# EasyEDA Pro project RAK3112 + RS485 P2P Node V1.1.epro

# Schematic Schematic1

## Sheets
1 P1: Board Name: Board1; Create Date: 2026-04-28; Page Name: P1; Project Name: RAK3312+ RS485; Schematic Name: Schematic1; Update Date: 2026-04-29; Company: EasyEDA.com; Page Size: A4; Version: V1.0
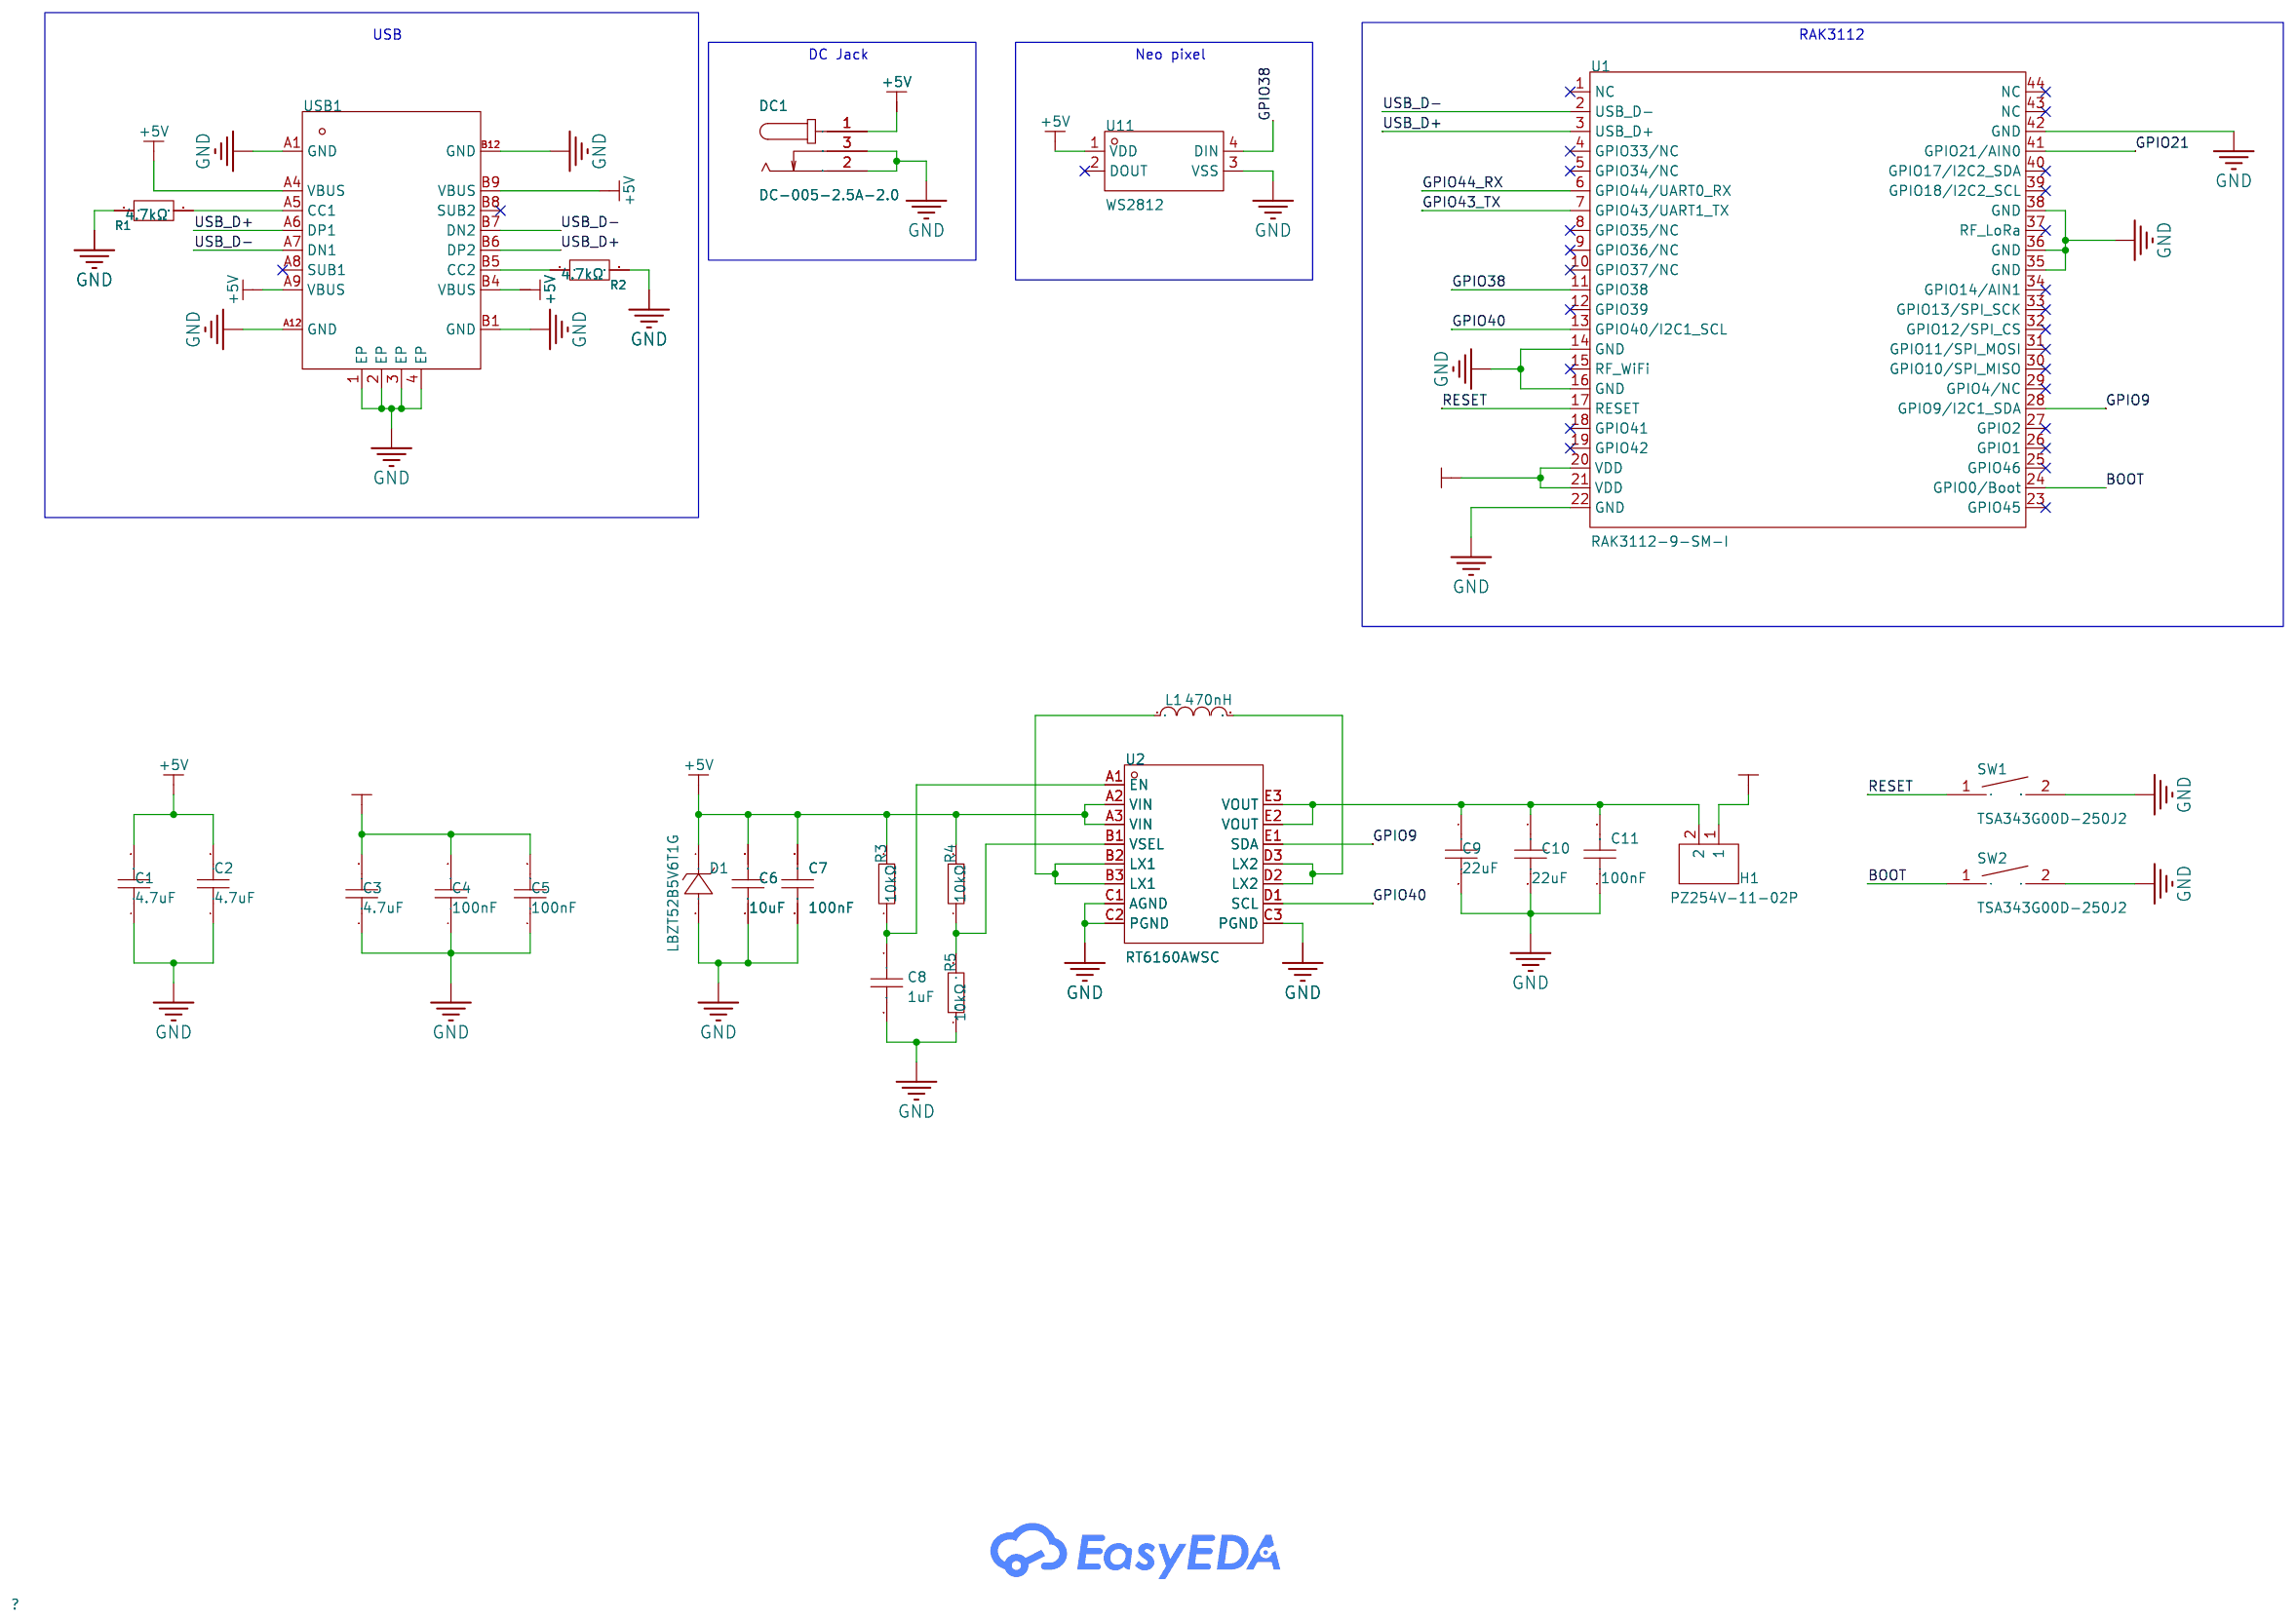
[diagram p0: P1]
2 RS484: Page Name: RS484
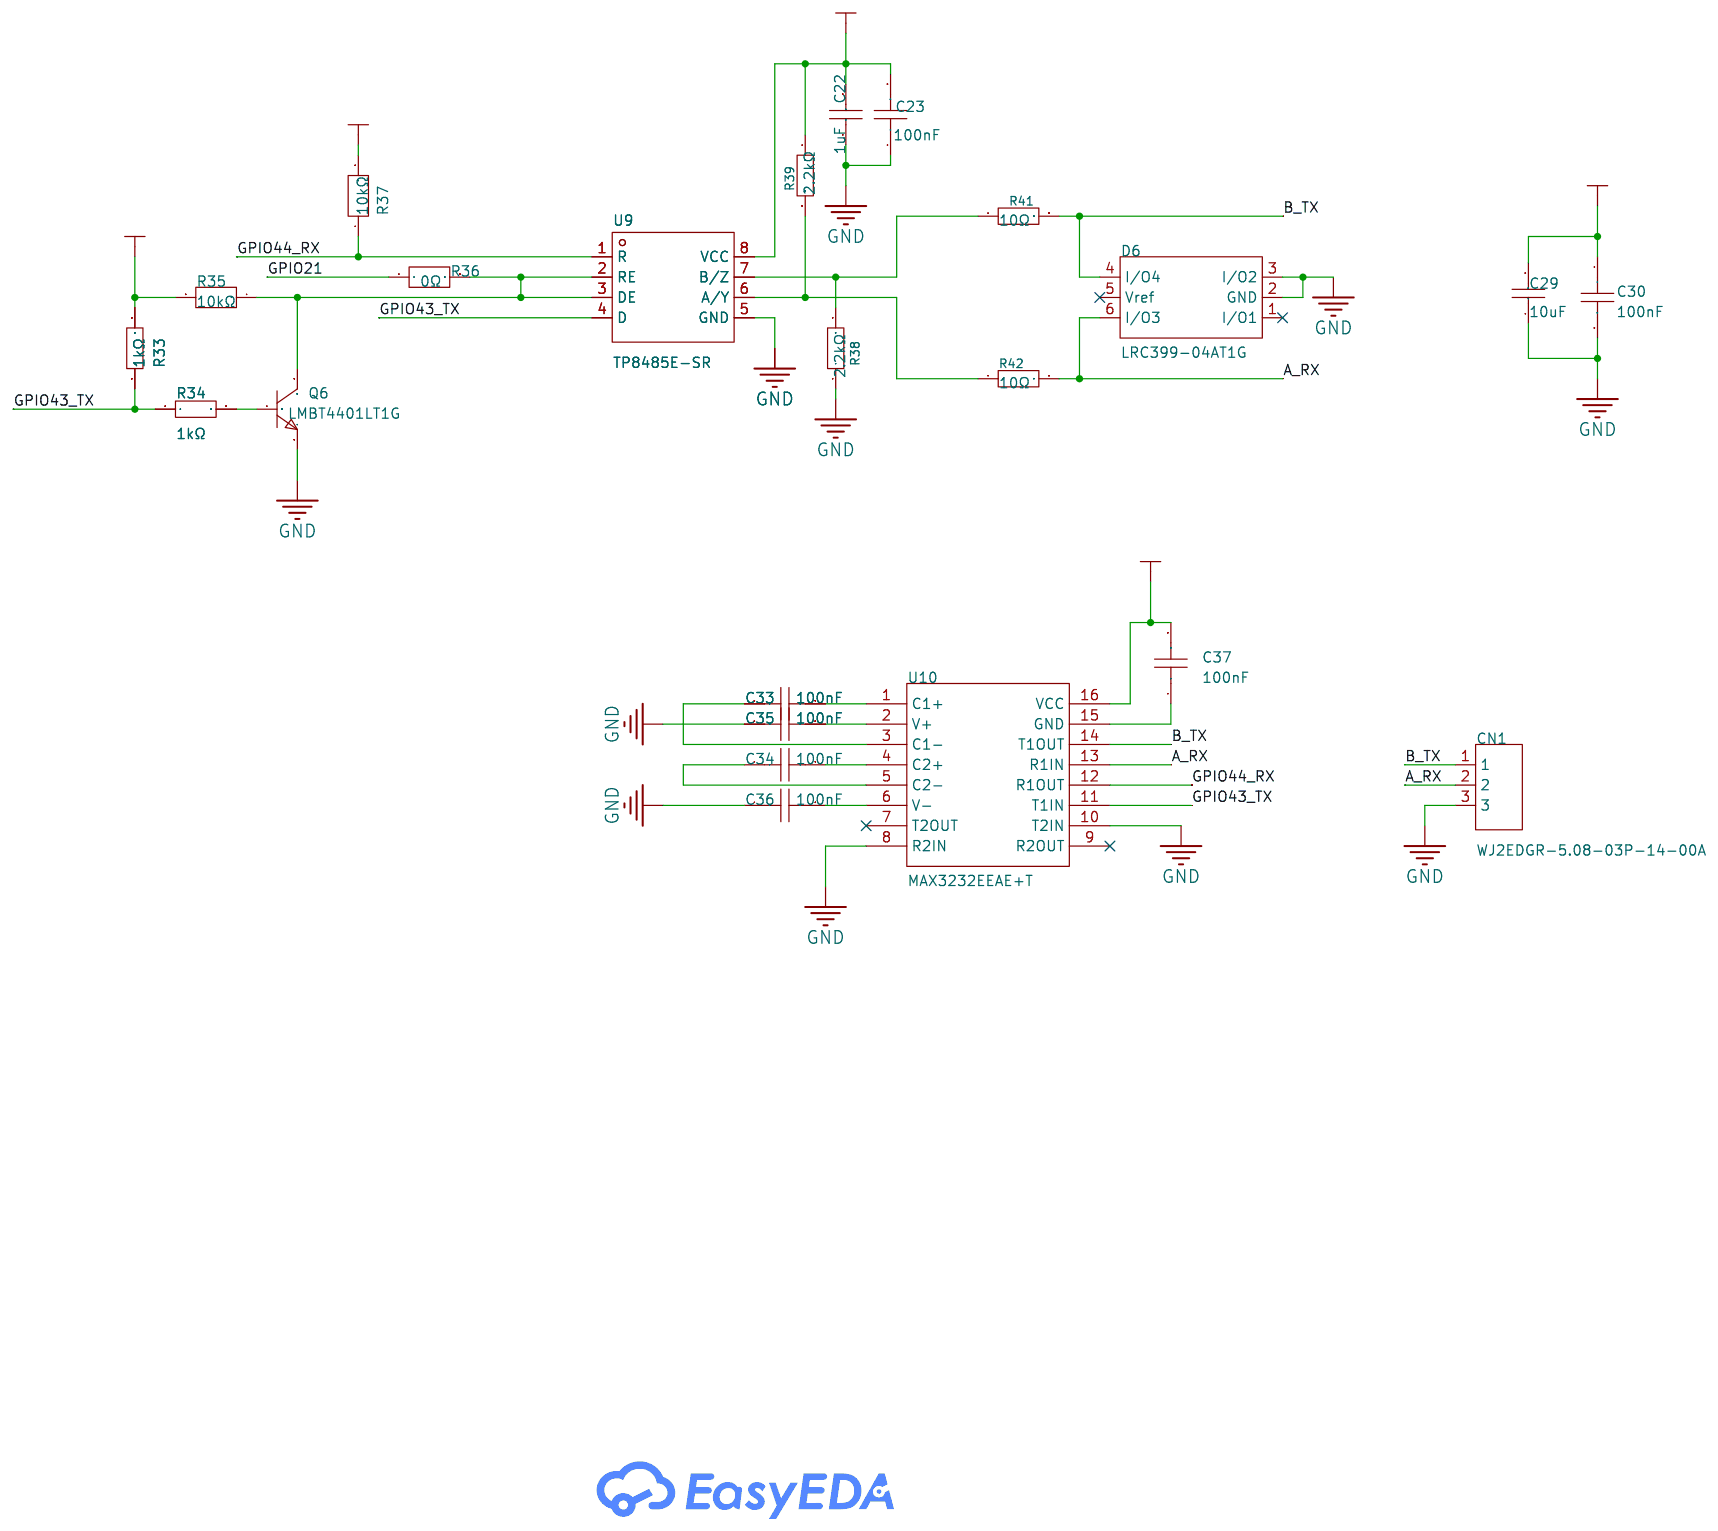
[diagram p1: RS484]

## Parts
sheet P1
C1  4.7uF  [C0603]
C2  4.7uF  [C0603]
C3  4.7uF  [C0603]
C4  100nF  [C0603]
C5  100nF  [C0603]
C6  10uF  [C0603]
C7  100nF  [C0603]
C8  1uF  [C0603]
C9  22uF  [C0603]
C10  22uF  [C0603]
C11  100nF  [C0603]
D1  LBZT52B5V6T1G  [SOD-123_L2.7-W1.6-LS3.7-RD-1]
DC1  DC-005-2.5A-2.0  [CONN-TH_DC-005-2.5A-2.0]
H1  PZ254V-11-02P  [HDR-TH_2P-P2.54-V-M]
L1  470nH  [IND-SMD_L4.4-W4.2]
R1  4.7kΩ  [R0603]
R2  4.7kΩ  [R0603]
R3  10kΩ  [R0603]
R4  10kΩ  [R0603]
R5  10kΩ  [R0603]
SW1  TSA343G00D-250J2  [SW-SMD_L4.0-W2.9-P4.15-EH]
SW2  TSA343G00D-250J2  [SW-SMD_L4.0-W2.9-P4.15-EH]
U1  RAK3112-9-SM-I  [COMM-SMD_44P-L23.0-W15.0-P1.20_RAK3112-9-SM-I]
U2  RT6160AWSC  [WLCSP-15_L2.3-W1.4-R3-C5-P0.40-BL]
U11  WS2812  [LED-SMD_4P-L5.0-W5.0-TL-A]
USB1  -  [USB-C-SMD_KH-TYPE-C-16P]
sheet RS484
C22  1uF  [C0402]
C23  100nF  [C0402]
C29  10uF  [C0402]
C30  100nF  [C0402]
C33  100nF  [C0603]
C34  100nF  [C0603]
C35  100nF  [C0603]
C36  100nF  [C0603]
C37  100nF  [C0603]
CN1  WJ2EDGR-5.08-03P-14-00A  [CONN-TH_3P-P5.08_WJ2EDGR-5.08-3P]
D6  LRC399-04AT1G  [TSOP-6_L3.0-W1.5-P0.95-BL]
Q6  LMBT4401LT1G  [SOT-23-3_L2.9-W1.3-P1.90-LS2.4-BR]
R33  1kΩ  [R0402]
R34  1kΩ  [R0402]
R35  10kΩ  [R0603]
R36  0Ω  [R0805]
R37  10kΩ  [R0603]
R38  2.2kΩ  [R0402]
R39  2.2kΩ  [R0402]
R41  10Ω  [R0402]
R42  10Ω  [R0402]
U9  TP8485E-SR  [SOIC-8_L5.0-W4.0-P1.27-LS6.0-BL]
U10  MAX3232EEAE+T  [SSOP-16_L6.2-W5.3-P0.65-LS7.8-BL]

## Library data of the parts
C1-C3 = CL10A475KO8NNNC: Capacitance:4.7uF Tolerance:±10% Tolerance:±10% Voltage Rating:16V Temperature Coefficient:X5R; LCSC Part Name: 4.7uF ±10% 16V; Supplier Part: C19666; Manufacturer: SAMSUNG(三星); Supplier Footprint: 0603; JLCPCB Part Class: Basic Part; Datasheet: https://item.szlcsc.com/datasheet/CL10A475KO8NNNC/20375.html; Supplier: LCSC; Tolerance: ±10%; Voltage Rating: 16V; Temperature Coefficient: X5R
C4 C5 C7 C11 = TCC0603X7R104K500CT: Capacitance:100nF Tolerance:±10% Tolerance:±10% Voltage Rating:50V Temperature Coefficient:X7R; LCSC Part Name: 100nF ±10% 50V; Supplier Part: C282519; Manufacturer: CCTC(三环); Supplier Footprint: 0603; JLCPCB Part Class: Extended Part; Datasheet: https://item.szlcsc.com/datasheet/TCC0603X7R104K500CT/268639.html; Supplier: LCSC; Tolerance: ±10%; Voltage Rating: 50V; Temperature Coefficient: X7R
C6 = CGA0603X5R106K100JT: Capacitance:10uF Tolerance:±10% Tolerance:±10% Voltage Rating:10V Temperature Coefficient:X5R; LCSC Part Name: 10uF ±10% 10V; Supplier Part: C6119842; Manufacturer: HRE(芯声); Supplier Footprint: 0603; JLCPCB Part Class: Extended Part; Datasheet: https://item.szlcsc.com/datasheet/CGA0603X5R106K100JT/7062548.html; Supplier: LCSC; Tolerance: ±10%; Voltage Rating: 10V; Temperature Coefficient: X5R
C8 = CL10B105KB8NQNC: Capacitance:1uF Tolerance:±10% Tolerance:±10% Voltage Rating:50V Temperature Coefficient:X7R; LCSC Part Name: 1uF ±10% 50V; Supplier Part: C5199872; Manufacturer: SAMSUNG(三星); Supplier Footprint: 0603; JLCPCB Part Class: Extended Part; Datasheet: https://item.szlcsc.com/datasheet/CL10B105KB8NQNC/5885909.html; Supplier: LCSC; Tolerance: ±10%; Voltage Rating: 50V; Temperature Coefficient: X7R
C9 C10 = CL10A226MQ8NRNC: Capacitance:22uF Tolerance:±20% Tolerance:±20% Voltage Rating:6.3V Temperature Coefficient:X5R; LCSC Part Name: 22uF ±20% 6.3V; Supplier Part: C59461; Manufacturer: SAMSUNG(三星); Supplier Footprint: 0603; JLCPCB Part Class: Basic Part; Datasheet: https://item.szlcsc.com/datasheet/CL10A226MQ8NRNC/60514.html; Supplier: LCSC; Tolerance: ±20%; Voltage Rating: 6.3V; Temperature Coefficient: X5R
D1 = LBZT52B5V6T1G: Diode Configuration:Independent Zener Voltage(Nom):5.6V Reverse Leakage Current (Ir):1uA Zener Voltage(Range):5.49V~5.73V Zener Voltage(Range):5.49V~5.73V Pd - Power Dissipation:500mW Impedance(Zzt):60Ω Impedance(Zzk):200Ω Operating Junction Temperature R; LCSC Part Name: 独立式 耐压:5.6V 电流:1uA; Supplier Part: C2912016; Manufacturer: LRC(乐山无线电); Supplier Footprint: SOD-123; JLCPCB Part Class: Extended Part; Datasheet: https://item.szlcsc.com/datasheet/LBZT52B5V6T1G/3194274.html; Supplier: LCSC; Diode Configuration: Independent; Zener Voltage(Nom): 5.6V; Reverse Leakage Current (Ir): 1uA; Zener Voltage(Range): 5.49V~5.73V; Pd - Power Dissipation: 500mW; Impedance(Zzt): 60Ω; Impedance(Zzk): 200Ω; Operating Junction Temperature Range: -55℃~+150℃
DC1 = DC-005-2.5A-2.0: Connector Type:DC Power Jack Mounting Type:Panel Mount Inside Contact Diameter:2mm Outside Contact Diameter:6.2mm Current Rating:- Voltage Rating (Max):- Operating Temperature:-20℃~+70℃ Operating Temperature:-20℃~+70℃; LCSC Part Name: DC电源插座 内径:2mm 外径:6.2mm; Supplier Part: C319099; Manufacturer: XKB Connection(中国星坤); Supplier Footprint: 插件; JLCPCB Part Class: Extended Part; Datasheet: https://item.szlcsc.com/datasheet/DC-005-2.5A-2.0/300191.html; Supplier: LCSC; Connector Type: DC Power Jack; Mounting Type: Panel Mount; Inside Contact Diameter: 2mm; Outside Contact Diameter: 6.2mm; Operating Temperature: -20℃~+70℃
H1 = PZ254V-11-02P: Pin Structure:1x2P Pitch:2.54mm Row Spacing:- Circluar Pins/Square Pins:Pin Header Mounting Type:Through Hole Number of Rows:1 Number of Pins:2P Current Rating:3A Voltage Rating (Max):250V Length of Mating Pin:6mm Insulation Height:2.5mm Length of End Con; LCSC Part Name: 1x2P 间距:2.54mm 方针 直插; Supplier Part: C492401; Manufacturer: XFCN(兴飞); Supplier Footprint: 插件,P=2.54mm; JLCPCB Part Class: Extended Part; Datasheet: https://item.szlcsc.com/datasheet/PZ254V-11-02P/502957.html; Supplier: LCSC; Pin Structure: 1x2P; Pitch: 2.54mm; Circluar Pins/Square Pins: Pin Header; Mounting Type: Through Hole; Number of Rows: 1; Number of Pins: 2P; Current Rating: 3A; Voltage Rating (Max): 250V; Length of Mating Pin: 6mm; Insulation Height: 2.5mm; Length of End Connection Pin: 3mm; Contact Material: Brass; Operating Temperature: -40℃~+105℃; Color: Black
L1 = FXL0420-R47-M: Inductance:470nH Tolerance:±20% Tolerance:±20% Current Rating:7.5A Current - Saturation(Isat):9.5A DC Resistance(DCR):14mΩ Type:Molded Inductor; LCSC Part Name: 470nH ±20% 9.5A; Supplier Part: C167200; Manufacturer: cjiang(长江微电); Supplier Footprint: SMD,4.4x4.2mm; JLCPCB Part Class: Extended Part; Datasheet: https://item.szlcsc.com/datasheet/FXL0420-R47-M/178583.html; Supplier: LCSC; Tolerance: ±20%; Current Rating: 7.5A; Current - Saturation(Isat): 9.5A; DC Resistance(DCR): 14mΩ; Type: Molded Inductor
R1 R2 = FRC0603J472 TS: Type:Thick Film Resistor Resistance:4.7kΩ Tolerance:±5% Tolerance:±5% Power(Watts):100mW Voltage-Supply(Max):75V Temperature Coefficient:±100ppm/℃ Temperature Coefficient:±100ppm/℃ Operating Temperature:-55℃~+155℃ Operating Temperature:-55℃~+155℃; LCSC Part Name: 4.7kΩ ±5% 100mW 厚膜电阻; Supplier Part: C2907166; Manufacturer: FOJAN(富捷); Supplier Footprint: 0603; JLCPCB Part Class: Extended Part; Supplier: LCSC; Type: Thick Film Resistor; Tolerance: ±5%; Power(Watts): 100mW; Voltage-Supply(Max): 75V; Temperature Coefficient: ±100ppm/℃; Operating Temperature: -55℃~+155℃
R3-R5 = RC0603FR-0710KL: Type:Thick Film Resistors Resistance: Tolerance:±1% Tolerance:±1% Power(Watts): Overload Voltage (Max): Temperature Coefficient:±100ppm/℃ Temperature Coefficient:±100ppm/℃ Operating Temperature Range:-55℃~+155℃ Operating Temperature Range:-55℃~+155℃; LCSC Part Name: 厚膜电阻 10kΩ ±1% 100mW; Supplier Part: C98220; Manufacturer: YAGEO(国巨); Supplier Footprint: 0603; JLCPCB Part Class: Extended Part; Datasheet: https://atta.szlcsc.com/upload/public/pdf/source/20180927/C295883_E8D83085EA81BD7DE0B2B681138C15EE.pdf; Supplier: LCSC; Type: Thick Film Resistors; Tolerance: ±1%; Temperature Coefficient: ±100ppm/℃; Operating Temperature Range: -55℃~+155℃
SW1 SW2 = TSA343G00D-250J2: Circuit:SPST Actuator Style:Round Button Operating Force:2.5N Mounting Type:Surface Mount,Vertical Length:4mm Width:3mm Switch Height:2mm with Bracket:Without Bracket Contact Current:50mA Voltage Rating:12V Actuator/Cap Color:Black With Lamp:No Terminatio; LCSC Part Name: 4x3x2mm两脚小龟 带柱 立贴 轻触开关; Supplier Part: C354947; Manufacturer: BRIGHT(博瑞泰); Supplier Footprint: SMD; JLCPCB Part Class: Extended Part; Datasheet: https://item.szlcsc.com/datasheet/TSA343G00D-250J2/330472.html; Supplier: LCSC; Circuit: SPST; Actuator Style: Round Button; Operating Force: 2.5N; Mounting Type: Surface Mount,Vertical; Length: 4mm; Width: 3mm; Switch Height: 2mm; with Bracket: Without Bracket; Contact Current: 50mA; Voltage Rating: 12V; Actuator/Cap Color: Black; With Lamp: No; Termination Style: SMD(SMT) Tab; Life: 50,000 Cycles; Operating Temperature: -25℃~+70℃
U1 = RAK3112-9-SM-I: LCSC Part Name: WisDuo Module for LoRaWAN RAK3112(H) /With IPEX/900MHz for US915/AU915/KR920/AS923; Supplier Part: C51883856; Manufacturer: RAK(瑞科慧联); JLCPCB Part Class: Extended Part; Datasheet: https://item.szlcsc.com/datasheet/RAK3112-9-SM-I/54552325.html; Supplier: LCSC
U2 = RT6160AWSC: Function:Boost type Output Type:Adjustable Input Voltage:2.2V~5.5V Input Voltage:2.2V~5.5V Output Current:3A Switching Frequency:2.2MHz Switching Frequency:2.2MHz Operating Temperature:-40℃~+125℃ Operating Temperature:-40℃~+125℃ Synchronous Rectification:; LCSC Part Name: 高效能3A升降压转换器; Supplier Part: C7065276; Manufacturer: RICHTEK(立锜); Supplier Footprint: WLCSP-15B(2.3x1.4); JLCPCB Part Class: Extended Part; Datasheet: https://atta.szlcsc.com/upload/public/pdf/source/231023/DS6160A-02-00831268e7d061f0dfa5290b00560405.pdf; Supplier: LCSC; Function: Boost type; Output Type: Adjustable; Input Voltage: 2.2V~5.5V; Output Current: 3A; Switching Frequency: 2.2MHz; Operating Temperature: -40℃~+125℃; Synchronous Rectification: Yes; Number of Outputs: 1; Topology: Step-down-Boost; Quiescent Current (Iq): 1uA; Switch tube (built-in/external): Built-in
U11 = WS2812: Supplier Part: C42417498; Manufacturer: worldsemi; Supplier Footprint: SMD5050-4P; JLCPCB Part Class: Extended Part; Datasheet: https://item.szlcsc.com/datasheet/WS2812/44423158.html; Supplier: LCSC
USB1 = USB_TYPE-C-16P: Supplier Footprint: Through
C22 = CL05A105KP5NNNC: Capacitance:1uF Tolerance:±10% Tolerance:±10% Voltage Rating:10V Temperature Coefficient:X5R; LCSC Part Name: 1uF ±10% 10V; Supplier Part: C14445; Manufacturer: SAMSUNG(三星); Supplier Footprint: 0402; JLCPCB Part Class: Extended Part; Datasheet: https://item.szlcsc.com/datasheet/CL05A105KP5NNNC/15107.html; Supplier: LCSC; Tolerance: ±10%; Voltage Rating: 10V; Temperature Coefficient: X5R
C23 C30 = FCC0402B104K160AT: Capacitance:100nF Tolerance:±10% Tolerance:±10% Voltage Rating:16V Temperature Coefficient:X7R; LCSC Part Name: 100nF ±10% 16V; Supplier Part: C5137468; Manufacturer: FOJAN(富捷); Supplier Footprint: 0402; JLCPCB Part Class: Extended Part; Datasheet: https://item.szlcsc.com/datasheet/FCC0402B104K160AT/5746970.html; Supplier: LCSC; Tolerance: ±10%; Voltage Rating: 16V; Temperature Coefficient: X7R
C29 = GRM155R60J106ME44D: Capacitance:10uF Tolerance:±20% Tolerance:±20% Voltage Rating:6.3V Temperature Coefficient:X5R; LCSC Part Name: 10uF ±20% 6.3V; Supplier Part: C76991; Manufacturer: muRata(村田); Supplier Footprint: 0402; JLCPCB Part Class: Extended Part; Datasheet: https://item.szlcsc.com/datasheet/GRM155R60J106ME44D/78118.html; Supplier: LCSC; Tolerance: ±20%; Voltage Rating: 6.3V; Temperature Coefficient: X5R
C33-C37 = CGA0603X7R104K100JT: Capacitance: Tolerance:±10% Tolerance:±10% Voltage Rating: Temperature Coefficient:; LCSC Part Name: 100nF ±10% 10V; Supplier Part: C36911391; Manufacturer: HRE(芯声); Supplier Footprint: 0603; JLCPCB Part Class: Extended Part; Datasheet: https://atta.szlcsc.com/upload/public/pdf/source/20240730/89545F503D4A4D0BCBA4819B495739F3.pdf; Supplier: LCSC; Tolerance: ±10%
CN1 = WJ2EDGR-5.08-03P-14-00A: Connector Type:Board Side/Socket - Open Termination Style:Hinged (Snap On) Number of Positions or Pins:1x3P Pitch:5.08mm Color:Green Mounting Type:Right-Angle Number of Pins:3P Number of Rows:1 Number of PINs Per Row:3 Current Rating:10A Voltage Rating (M; LCSC Part Name: 卡扣固定 1x3P 5.08mm 排数:1 每排P数:3; Supplier Part: C70914; Manufacturer: KANGNEX(康奈克斯电气); Supplier Footprint: 弯插,P=5.08mm; JLCPCB Part Class: Extended Part; Datasheet: https://item.szlcsc.com/datasheet/WJ2EDGR-5.08-03P-14-00A/72013.html; Supplier: LCSC; Connector Type: Board Side/Socket - Open; Termination Style: Hinged (Snap On); Number of Positions or Pins: 1x3P; Pitch: 5.08mm; Color: Green; Mounting Type: Right-Angle; Number of Pins: 3P; Number of Rows: 1; Number of PINs Per Row: 3; Current Rating: 10A; Voltage Rating (Max): 300V; Operating Temperature: -40℃~+105℃
D6 = LRC399-04AT1G: Reverse Stand-Off Voltage (Vrwm):5V Clamping Voltage:8.5V Voltage - Breakdown:6V Reverse Leakage Current (Ir):1uA Type:ESD; Supplier Part: C5274371; Manufacturer: LRC(乐山无线电); Supplier Footprint: TSOP-6; JLCPCB Part Class: Extended Part; Datasheet: https://atta.szlcsc.com/upload/public/pdf/source/20221213/22056EDC41646EC6D8A74880FBA83D1E.pdf; Supplier: LCSC; Reverse Stand-Off Voltage (Vrwm): 5V; Clamping Voltage: 8.5V; Voltage - Breakdown: 6V; Reverse Leakage Current (Ir): 1uA; Type: ESD
Q6 = LMBT4401LT1G: type:NPN Current - Collector(Ic):600mA Collector - Emitter Voltage VCEO:40V Pd - Power Dissipation:225mW DC Current Gain:20@0.1mA,1V DC Current Gain:20@0.1mA,1V Transition frequency(fT):250MHz Current - Collector Cutoff:100nA Vce Saturation(VCE(sat)):400m; LCSC Part Name: 丝印2X NPN 电流:600mA 电压:40V; Supplier Part: C78591; Manufacturer: LRC(乐山无线电); Supplier Footprint: SOT-23; JLCPCB Part Class: Extended Part; Datasheet: https://item.szlcsc.com/datasheet/LMBT4401LT1G/79727.html; Supplier: LCSC; type: NPN; Current - Collector(Ic): 600mA; Collector - Emitter Voltage VCEO: 40V; Pd - Power Dissipation: 225mW; DC Current Gain: 20@0.1mA,1V; Transition frequency(fT): 250MHz; Current - Collector Cutoff: 100nA; Vce Saturation(VCE(sat)): 400mV; Operating Temperature: -55℃~+150℃
R33 R34 = 0402WGF1001TCE: Type:Thick Film Resistor Resistance:1kΩ Tolerance:±1% Tolerance:±1% Power(Watts):62.5mW Voltage-Supply(Max):50V Temperature Coefficient:±100ppm/℃ Temperature Coefficient:±100ppm/℃ Operating Temperature:-55℃~+155℃ Operating Temperature:-55℃~+155℃; LCSC Part Name: 1kΩ ±1% 62.5mW 厚膜电阻; Supplier Part: C11702; Manufacturer: UNI-ROYAL(厚声); Supplier Footprint: 0402; JLCPCB Part Class: Basic Part; Datasheet: https://item.szlcsc.com/datasheet/0402WGF1001TCE/12256.html; Supplier: LCSC; Type: Thick Film Resistor; Tolerance: ±1%; Power(Watts): 62.5mW; Voltage-Supply(Max): 50V; Temperature Coefficient: ±100ppm/℃; Operating Temperature: -55℃~+155℃
R35 R37 = FRC0603J103 TS: Type:Thick Film Resistor Resistance:10kΩ Tolerance:±5% Tolerance:±5% Power(Watts):100mW Voltage-Supply(Max):75V Temperature Coefficient:±100ppm/℃ Temperature Coefficient:±100ppm/℃ Operating Temperature:-55℃~+155℃ Operating Temperature:-55℃~+155℃; LCSC Part Name: 10kΩ ±5% 100mW 厚膜电阻; Supplier Part: C2930027; Manufacturer: FOJAN(富捷); Supplier Footprint: 0603; JLCPCB Part Class: Extended Part; Datasheet: https://item.szlcsc.com/datasheet/FRC0603J103%2520TS/3266960.html; Supplier: LCSC; Type: Thick Film Resistor; Tolerance: ±5%; Power(Watts): 100mW; Voltage-Supply(Max): 75V; Temperature Coefficient: ±100ppm/℃; Operating Temperature: -55℃~+155℃
R36 = YLRY05-W2-0Z: Resistance:0Ω Power(Watts):500mW; LCSC Part Name: YLRY系列 0.5W 0mΩ; Supplier Part: C22468035; Manufacturer: yezhan(业展); Supplier Footprint: 0805; JLCPCB Part Class: Extended Part; Datasheet: https://item.szlcsc.com/datasheet/YLRY05-W2-0Z/24173369.html; Supplier: LCSC; Power(Watts): 500mW
R38 R39 = 0402WGF2201TCE: Type:Thick Film Resistor Resistance:2.2kΩ Tolerance:±1% Tolerance:±1% Power(Watts):62.5mW Voltage-Supply(Max):50V Temperature Coefficient:±100ppm/℃ Temperature Coefficient:±100ppm/℃ Operating Temperature:-55℃~+155℃ Operating Temperature:-55℃~+155℃; LCSC Part Name: 2.2kΩ ±1% 62.5mW 厚膜电阻; Supplier Part: C25879; Manufacturer: UNI-ROYAL(厚声); Supplier Footprint: 0402; JLCPCB Part Class: Basic Part; Datasheet: https://item.szlcsc.com/datasheet/0402WGF2201TCE/26622.html; Supplier: LCSC; Type: Thick Film Resistor; Tolerance: ±1%; Power(Watts): 62.5mW; Voltage-Supply(Max): 50V; Temperature Coefficient: ±100ppm/℃; Operating Temperature: -55℃~+155℃
R41 R42 = 0402WGF100JTCE: Type:Thick Film Resistor Resistance:10Ω Tolerance:±1% Tolerance:±1% Power(Watts):62.5mW Voltage-Supply(Max):50V Temperature Coefficient:±200ppm/℃ Temperature Coefficient:±200ppm/℃ Operating Temperature:-55℃~+155℃ Operating Temperature:-55℃~+155℃; LCSC Part Name: 10Ω ±1% 62.5mW 厚膜电阻; Supplier Part: C25077; Manufacturer: UNI-ROYAL(厚声); Supplier Footprint: 0402; JLCPCB Part Class: Basic Part; Datasheet: https://item.szlcsc.com/datasheet/0402WGF100JTCE/25820.html; Supplier: LCSC; Type: Thick Film Resistor; Tolerance: ±1%; Power(Watts): 62.5mW; Voltage-Supply(Max): 50V; Temperature Coefficient: ±200ppm/℃; Operating Temperature: -55℃~+155℃
U9 = TP8485E-SR: Types:Transceiver Number of Driver:1 Number of receiver:1 Supply Voltage:3V~5.5V Supply Voltage:3V~5.5V Data Rate:250Kbps Data Rate:250Kbps Node Number:256 ESD Protect:±18kV ESD Protect:±18kV Operating Temperature:-40℃~+125℃ Operating Temperature:-40℃~+12; LCSC Part Name: ±18K ESD保护，全故障安全RS-485收发器; Supplier Part: C94206; Manufacturer: 3PEAK(思瑞浦); Supplier Footprint: SOIC-8; JLCPCB Part Class: Extended Part; Datasheet: https://atta.szlcsc.com/upload/public/pdf/source/20170120/1484891310884.pdf; Supplier: LCSC; Types: Transceiver; Number of Driver: 1; Number of receiver: 1; Supply Voltage: 3V~5.5V; Data Rate: 250Kbps; Node Number: 256; ESD Protect: ±18kV; Operating Temperature: -40℃~+125℃
U10 = MAX3232EEAE+T: Type:transceiver Number of Drivers:- Number of Receivers:- Data Rate:1Mbps Data Rate:1Mbps Voltage - Supply:3V~5.5V Voltage - Supply:3V~5.5V ESD Protect:±15kV ESD Protect:±15kV charge pump:Yes Operating Temperature:-40℃~+85℃ Operating Temperature:-40℃~+85; LCSC Part Name: ±15kV ESD 保护，低至 10nA，3.0V 至 5.5V，高达 1Mbps，真正的 RS-232 收发器; Supplier Part: C33379; Manufacturer: ADI(亚德诺)/MAXIM(美信); Supplier Footprint: SSOP-16-208mil; JLCPCB Part Class: Extended Part; Datasheet: https://item.szlcsc.com/datasheet/MAX3232EEAE%252BT/34344.html; Supplier: LCSC; Type: transceiver; Data Rate: 1Mbps; Voltage - Supply: 3V~5.5V; ESD Protect: ±15kV; charge pump: Yes; Operating Temperature: -40℃~+85℃

## Nets
3V3: C3.2 C4.2 C5.2 C22.2 C23.2 C29.2 C30.1 C37.2 H1.1 R33.2 R35.2 R37.2 R39.1 U1.20(VDD) U1.21(VDD) U9.8(VCC) U10.16(VCC)
+5V: C1.2 C2.2 C6.2 C7.2 D1.1(K) DC1.1 R3.2 R4.2 U2.A2(VIN) U2.A3(VIN) U11.1(VDD) USB1.A4(VBUS) USB1.A9(VBUS) USB1.B4(VBUS) USB1.B9(VBUS)
GND: C1.1 C2.1 C3.1 C4.1 C5.1 C6.1 C7.1 C8.2 C9.2 C10.2 C11.1 C22.1 C23.1 C29.1 C30.2 C35.1 C36.1 CN1.3 D1.2(A) D6.2(GND) D6.3(I/O2) DC1.2 DC1.3 Q6.2(E) R1.1 R2.2 R5.1 R38.1 SW1.2 SW2.2 U1.14(GND) U1.16(GND) U1.22(GND) U1.35(GND) U1.36(GND) U1.38(GND) U1.42(GND) U2.C1(AGND) U2.C2(PGND) U2.C3(PGND) U9.5(GND) U10.8(R2IN) U10.10(T2IN) U11.3(VSS) USB1.1(EP) USB1.2(EP) USB1.3(EP) USB1.4(EP) USB1.A1(GND) USB1.A12(GND) USB1.B1(GND) USB1.B12(GND)
A_RX: CN1.2 D6.6(I/O3) R42.2 U10.13(R1IN)
B_TX: CN1.1 D6.4(I/O4) R41.2 U10.14(T1OUT)
BOOT: SW2.1 U1.24(GPIO0/Boot)
GPIO9: U1.28(GPIO9/I2C1_SDA) U2.E1(SDA)
GPIO21: R36.1 U1.41(GPIO21/AIN0)
GPIO38: U1.11(GPIO38) U11.4(DIN)
GPIO40: U1.13(GPIO40/I2C1_SCL) U2.D1(SCL)
GPIO43_TX: R33.1 R34.1 U1.7(GPIO43/UART1_TX) U9.4(D) U10.11(T1IN)
GPIO44_RX: R37.1 U1.6(GPIO44/UART0_RX) U9.1(R) U10.12(R1OUT)
RESET: SW1.1 U1.17(RESET)
USB_D+: U1.3(USB_D+) USB1.A6(DP1) USB1.B6(DP2)
USB_D-: U1.2(USB_D-) USB1.A7(DN1) USB1.B7(DN2)
$1N1486: R2.1 USB1.B5(CC2)
$1N1504: L1.1 U2.B2(LX1) U2.B3(LX1)
$1N1505: L1.2 U2.D2(LX2) U2.D3(LX2)
$1N1525: R1.2 USB1.A5(CC1)
$1N1571: C9.1 C10.1 C11.2 H1.2 U2.E2(VOUT) U2.E3(VOUT)
$1N1577: C8.1 R3.1 U2.A1(EN)
$1N1589: R4.1 R5.2 U2.B1(VSEL)
$2N1090: Q6.1(B) R34.2
$2N1107: R39.2 R42.1 U9.6(A/Y)
$2N1108: R38.2 R41.1 U9.7(B/Z)
$2N1109: Q6.3(C) R35.1 R36.2 U9.2(RE) U9.3(DE)
$2N1110: C33.1 U10.3(C1-)
$2N1111: C34.1 U10.5(C2-)
$2N1112: C33.2 U10.1(C1+)
$2N1113: C34.2 U10.4(C2+)
$2N1124: C35.2 U10.2(V+)
$2N1126: C36.2 U10.6(V-)
$2N1128: C37.1 U10.15(GND)

Not connected (* = marked no-connect by the designer): D6 1(I/O1)* 5(Vref)*; U1 1(NC)* 4(GPIO33/NC)* 5(GPIO34/NC)* 8(GPIO35/NC)* 9(GPIO36/NC)* 10(GPIO37/NC)* 12(GPIO39)* 15(RF_WiFi)* 18(GPIO41)* 19(GPIO42)* 23(GPIO45)* 25(GPIO46)* 26(GPIO1)* 27(GPIO2)* 29(GPIO4/NC)* 30(GPIO10/SPI_MISO)* 31(GPIO11/SPI_MOSI)* 32(GPIO12/SPI_CS)* 33(GPIO13/SPI_SCK)* 34(GPIO14/AIN1)* 37(RF_LoRa)* 39(GPIO18/I2C2_SCL)* 40(GPIO17/I2C2_SDA)* 43(NC)* 44(NC)*; U10 7(T2OUT)* 9(R2OUT)*; U11 2(DOUT)*; USB1 A8(SUB1)* B8(SUB2)*

## Notes on the sheets
sheet 1
- USB
- RAK3112
- DC Jack
- Neo pixel

# Board PCB1
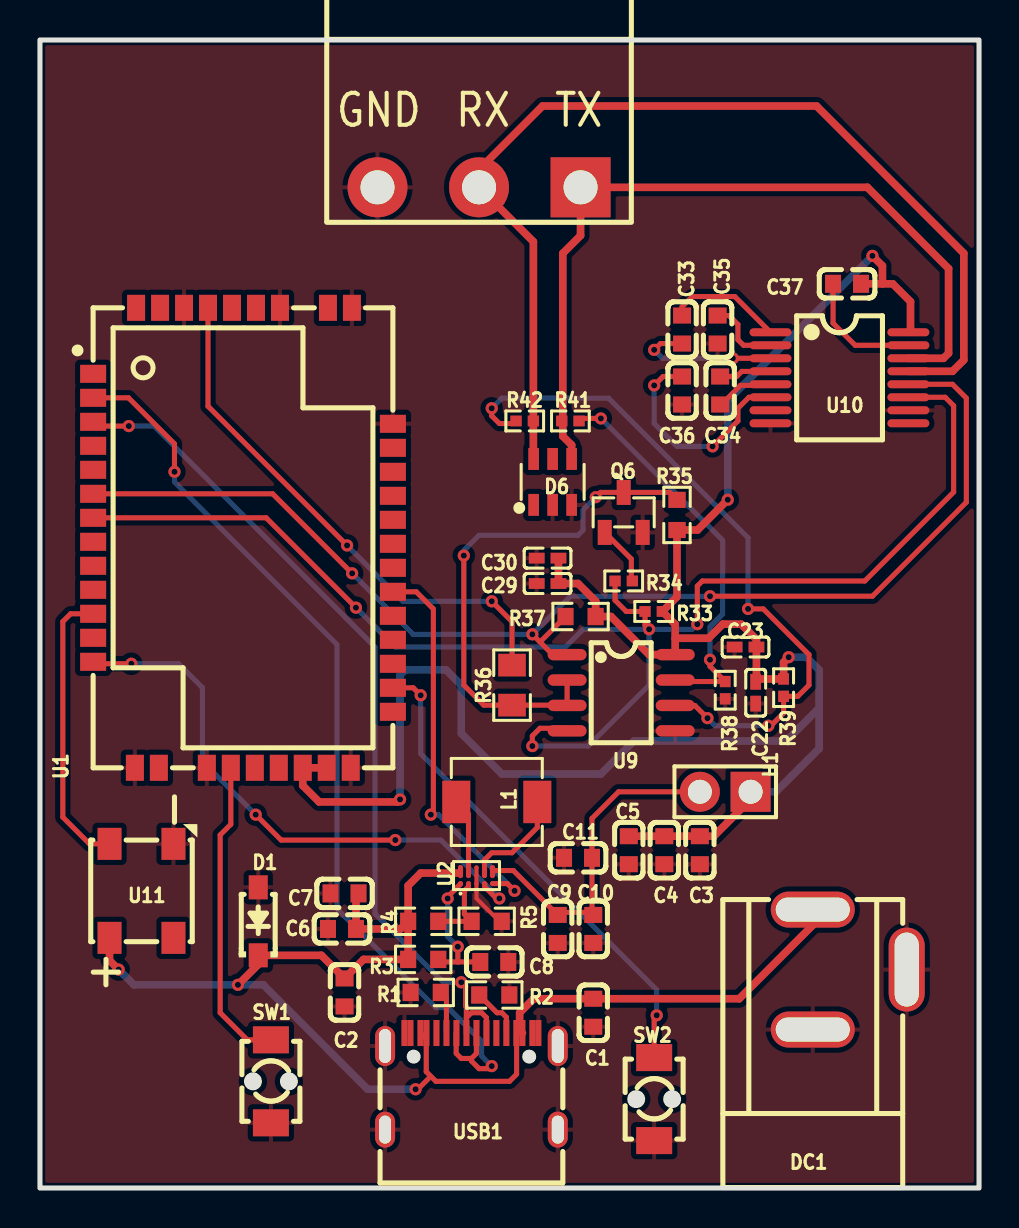
[diagram p2: board, top side]
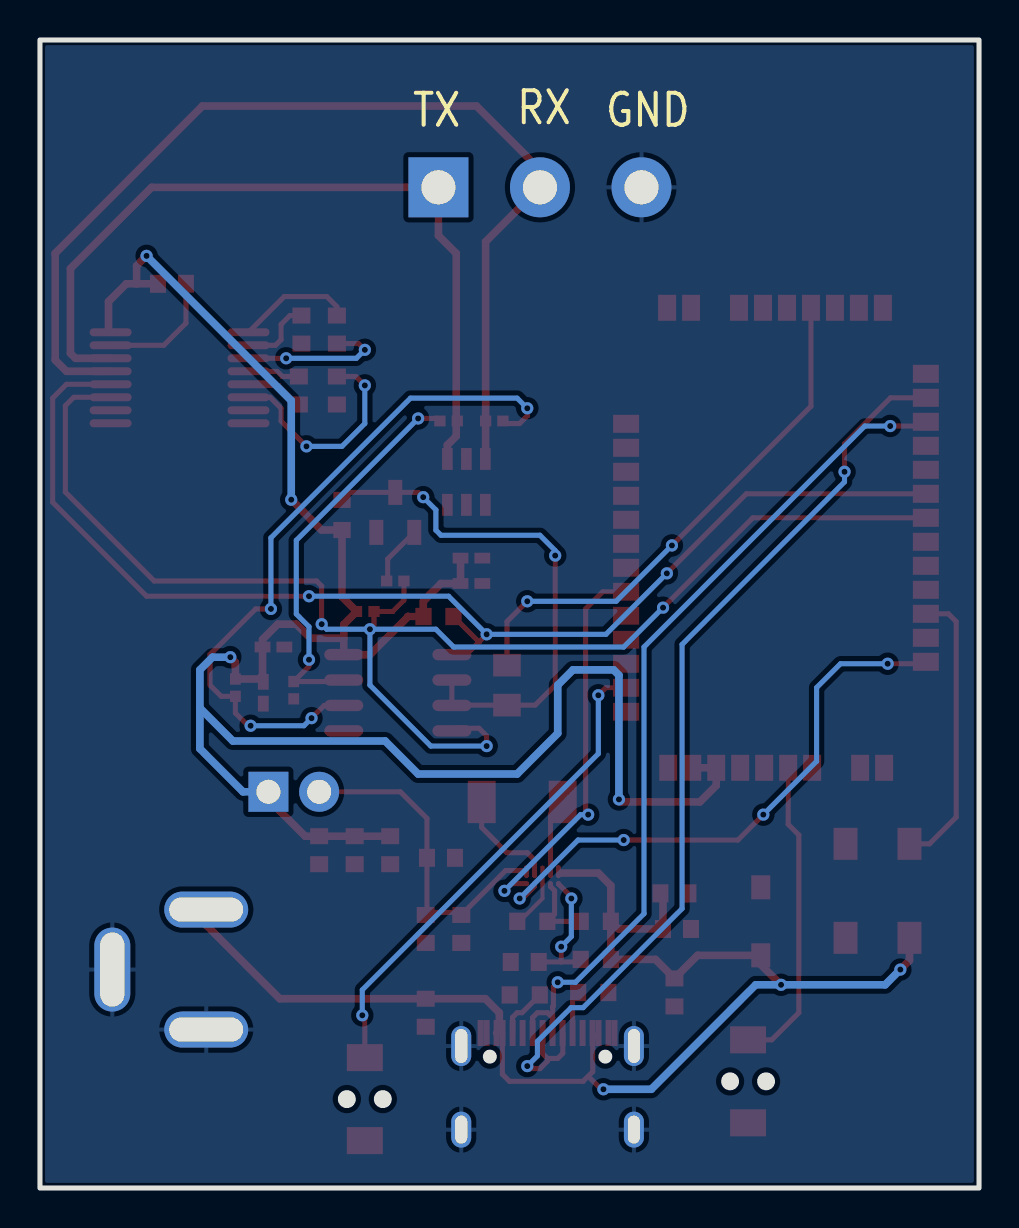
[diagram p3: board, bottom side, seen from below]

Outline 46.99 x 57.4 mm; copper layers: Top Layer, Bottom Layer. Coordinates in mm from the lower left corner of the outline.
Outline path: rectangle 0,57.4 46.99,0
Stack: Top Layer 0.035mm / Dielectric1 1.51mm FR4 er 4.5 / Bottom Layer 0.035mm

## Design rules (mm)
template: JLCPCB Capability(Two Layers Board)
spacing copperThickness1oz (default): track to track 0.102, other pairs 0.152 to 0.3
spacing copperThickness2oz: track to track 0.203, other pairs 0.152 to 0.3
track width copperThickness1oz (default): min 0.127, default 0.254, max 2.54
track width copperThickness2oz: min 0.203, default 0.254, max 2.54
differential pair differentialPair (default): width min 0.127, default 0.254, max 2.54; gap min 0.152, default 0.152
via viaSize (default): diameter min 0.5, default 0.61, max 10; hole min 0.3, default 0.305, max 6.3

## Placement (name value [footprint] x y rotation side)
C1  4.7uF  [C0603]  27.69 8.76 90 top
C2  4.7uF  [C0603]  15.24 9.78 90 top
C3  4.7uF  [C0603]  33.02 16.89 90 top
C4  100nF  [C0603]  31.24 16.89 90 top
C5  100nF  [C0603]  29.46 16.89 90 top
C6  10uF  [C0603]  15.11 12.95 0 top
C7  100nF  [C0603]  15.24 14.73 0 top
C8  1uF  [C0603]  22.73 11.3 0 top
C9  22uF  [C0603]  25.91 12.95 270 top
C10  22uF  [C0603]  27.69 12.95 270 top
C11  100nF  [C0603]  26.92 16.51 0 top
C22  1uF  [C0402]  35.81 24.77 90 top
C23  100nF  [C0402]  35.31 27.05 0 top
C29  10uF  [C0402]  25.4 30.23 0 top
C30  100nF  [C0402]  25.4 31.5 180 top
C33  100nF  [C0603]  32.13 42.93 90 top
C34  100nF  [C0603]  34.04 39.88 90 top
C35  100nF  [C0603]  33.91 42.93 90 top
C36  100nF  [C0603]  32.13 39.88 90 top
C37  100nF  [C0603]  40.39 45.21 0 top
CN1  WJ2EDGR-5.08-03P-14-00A  [CONN-TH_3P-P5.08_WJ2EDGR-5.08-3P]  21.97 50.04 180 top
D1  LBZT52B5V6T1G  [SOD-123_L2.7-W1.6-LS3.7-RD-1]  10.92 13.34 90 top
D6  LRC399-04AT1G  [TSOP-6_L3.0-W1.5-P0.95-BL]  25.65 35.31 0 top
DC1  DC-005-2.5A-2.0  [CONN-TH_DC-005-2.5A-2.0]  41.02 10.92 90 top
H1  PZ254V-11-02P  [HDR-TH_2P-P2.54-V-M]  34.29 19.81 180 top
L1  470nH  [IND-SMD_L4.4-W4.2]  22.86 19.3 180 top
Q6  LMBT4401LT1G  [SOT-23-3_L2.9-W1.3-P1.90-LS2.4-BR]  29.21 33.78 270 top
R1  4.7kΩ  [R0603]  19.3 9.78 0 top
R2  4.7kΩ  [R0603]  22.73 9.65 0 top
R3  10kΩ  [R0603]  19.18 11.43 180 top
R4  10kΩ  [R0603]  19.18 13.34 180 top
R5  10kΩ  [R0603]  22.35 13.34 180 top
R33  1kΩ  [R0402]  30.71 28.83 0 top
R34  1kΩ  [R0402]  29.21 30.35 0 top
R35  10kΩ  [R0603]  31.88 33.66 270 top
R36  0Ω  [R0805]  23.62 25.15 270 top
R37  10kΩ  [R0603]  27.05 28.58 0 top
R38  2.2kΩ  [R0402]  34.29 24.89 90 top
R39  2.2kΩ  [R0402]  37.21 25.02 270 top
R41  10Ω  [R0402]  26.54 38.35 180 top
R42  10Ω  [R0402]  24.26 38.35 0 top
SW1  TSA343G00D-250J2  [SW-SMD_L4.0-W2.9-P4.15-EH]  11.56 5.33 270 top
SW2  TSA343G00D-250J2  [SW-SMD_L4.0-W2.9-P4.15-EH]  30.73 4.45 270 top
U1  RAK3112-9-SM-I  [COMM-SMD_44P-L23.0-W15.0-P1.20_RAK3112-9-SM-I]  10.16 32.51 90 top
U2  RT6160AWSC  [WLCSP-15_L2.3-W1.4-R3-C5-P0.40-BL]  21.84 15.62 0 top
U9  TP8485E-SR  [SOIC-8_L5.0-W4.0-P1.27-LS6.0-BL]  29.08 24.77 270 top
U10  MAX3232EEAE+T  [SSOP-16_L6.2-W5.3-P0.65-LS7.8-BL]  40 40.51 270 top
U11  WS2812  [LED-SMD_4P-L5.0-W5.0-TL-A]  5.08 14.86 90 top
USB1  -  [USB-C-SMD_KH-TYPE-C-16P]  21.59 5.33 0 top

## Footprints (pads in the part's own frame, mm; a bottom-side part is the same pattern mirrored in y, then rotated)
C0402
  rect 0.79x0.54 smd: 1(-0.545,0) 2(0.545,0)
C0603
  rect 0.8x0.9 smd: 1(-0.7,0) 2(0.7,0)
COMM-SMD_44P-L23.0-W15.0-P1.20_RAK3112-9-SM-I
  rect 0.9x1.3 smd: 1(8.2,7.5) 2(7,7.5) 3(5.8,7.5) 4(4.6,7.5) 5(3.4,7.5) 6(2.2,7.5) 7(1,7.5) 8(-0.2,7.5) 9(-1.4,7.5) 10(-2.6,7.5) 11(-3.8,7.5) 12(-5,7.5) 13(-6.2,7.5) 23(-8.7,-7.5) 24(-7.5,-7.5) 25(-6.3,-7.5) 26(-5.1,-7.5) 27(-3.9,-7.5) 28(-2.7,-7.5) 29(-1.5,-7.5) 30(-0.3,-7.5) 31(0.9,-7.5) 32(2.1,-7.5) 33(3.3,-7.5) 34(4.5,-7.5) 35(5.7,-7.5)
  rect 1.3x0.9 smd: 14(-11.5,5.41) 15(-11.5,4.21) 16(-11.5,1.81) 17(-11.5,0.61) 18(-11.5,-0.59) 19(-11.5,-1.79) 20(-11.5,-2.99) 21(-11.5,-4.19) 22(-11.5,-5.39) 36(11.5,-5.45) 37(11.5,-4.25) 38(11.5,-1.85) 39(11.5,-0.65) 40(11.5,0.55) 41(11.5,1.75) 42(11.5,2.95) 43(11.5,4.15) 44(11.5,5.35)
CONN-TH_3P-P5.08_WJ2EDGR-5.08-3P
  rect 3x3 hole 1.7: 1(-5.08,0)
  round 3 hole 1.7: 2(0,0) 3(5.08,0)
CONN-TH_DC-005-2.5A-2.0
  oval 1.8x4.2 hole 1.2x3.7: 1(2.999,2.35) 2(-2.999,2.35)
  oval 4.2x1.8 hole 3.7x1.2: 3(0,-2.35)
HDR-TH_2P-P2.54-V-M
  rect 2x2 hole 1.2: 1(-1.27,0)
  round 2 hole 1.2: 2(1.27,0)
IND-SMD_L4.4-W4.2
  rect 1.4x2.12 smd: 1(2.028,0) 2(-2.028,0)
LED-SMD_4P-L5.0-W5.0-TL-A
  rect 1.6x1.2 smd: 1(-2.35,1.6) 2(-2.35,-1.6) 3(2.35,-1.6) 4(2.35,1.6)
R0402
  rect 0.566x0.54 smd: 1(-0.433,0) 2(0.433,0)
R0603
  rect 0.806x0.864 smd: 1(-0.753,0) 2(0.753,0)
R0805
  rect 1.133x1.377 smd: 1(-1,0) 2(1,0)
SOD-123_L2.7-W1.6-LS3.7-RD-1
  rect 1.2x0.95 smd: 1(-1.7,0) 2(1.7,0)
SOIC-8_L5.0-W4.0-P1.27-LS6.0-BL
  oval 0.569x1.95 smd: 1(-1.905,-2.705) 2(-0.635,-2.705) 3(0.635,-2.705) 4(1.905,-2.705) 5(1.905,2.705) 6(0.635,2.705) 7(-0.635,2.705) 8(-1.905,2.705)
SOT-23-3_L2.9-W1.3-P1.90-LS2.4-BR
  rect 1.25x0.7 smd: 1(1,-0.95) 2(1,0.95) 3(-1,0)
SSOP-16_L6.2-W5.3-P0.65-LS7.8-BL
  oval 0.4x2.1 smd: 1(-2.275,-3.45) 2(-1.625,-3.45) 3(-0.975,-3.45) 4(-0.325,-3.45) 5(0.325,-3.45) 6(0.975,-3.45) 7(1.625,-3.45) 8(2.275,-3.45) 9(2.275,3.45) 10(1.625,3.45) 11(0.975,3.45) 12(0.325,3.45) 13(-0.325,3.45) 14(-0.975,3.45) 15(-1.625,3.45) 16(-2.275,3.45)
SW-SMD_L4.0-W2.9-P4.15-EH
  rect 1.35x1.8 smd: 1(-2.075,0) 2(2.075,0)
TSOP-6_L3.0-W1.5-P0.95-BL
  rect 0.532x1.095 smd: 1(-0.95,-1.147) 2(0,-1.147) 3(0.95,-1.147) 4(0.95,1.147) 5(0,1.147) 6(-0.95,1.147)
USB-C-SMD_KH-TYPE-C-16P
  oval 1x2 hole 0.6x1.7: 1(-4.32,1.765) 2(4.32,1.765)
  oval 1x1.8 hole 0.6x1.4: 3(-4.32,-2.415) 4(4.32,-2.415)
  rect 0.3x1.3 smd: A1(-3.35,2.415) A4(-2.55,2.415) A5(-1.25,2.415) A6(-0.25,2.415) A7(0.25,2.415) A8(1.25,2.415) A9(2.55,2.415) A12(3.35,2.415) B1(3.05,2.415) B4(2.25,2.415) B5(1.75,2.415) B6(0.75,2.415) B7(-0.75,2.415) B8(-1.75,2.415) B9(-2.25,2.415) B12(-3.05,2.415)
WLCSP-15_L2.3-W1.4-R3-C5-P0.40-BL
  round 0.216 smd: A1(-0.8,-0.4) A2(-0.8,0) A3(-0.8,0.4) B1(-0.4,-0.4) B2(-0.4,0) B3(-0.4,0.4) C1(0,-0.4) C2(0,0) C3(0,0.4) D1(0.4,-0.4) D2(0.4,0) D3(0.4,0.4) E1(0.8,-0.4) E2(0.8,0) E3(0.8,0.4)

## Nets
As in the schematic.

Pads without a net: D6 1 5; U1 1 4 5 8 9 10 12 15 18 19 23 25 26 27 29 30 31 32 33 34 37 39 40 43 44; U10 7 9; U11 2; USB1 A8 B8

## Via types
v1: diameter 0.61, hole 0.305, Top Layer to Bottom Layer, 42 vias

## Routing (per net, layer and track width the routed paths; a pad name or vN(x,y) marks a point on that pad's centre or on a via; arc(x,y) is an arc through that point)
3V3: length 106.5
  Top Layer w0.381: U10.16 43.56,42.89 43.56,44.32 42.67,45.21 42.16,45.21 ; C5.2 C4.2 C3.2 33.72,17.59 35.56,19.43 H1.1 ; v1(34.42,34.42) 32.9,32.9 R35.2 31.88,29.56 R33.2 31.79,28.18 31.79,27.49 ; 42.16,45.21 42.16,46.11 v1(41.66,46.61) ; 42.16,45.21 C37.2 ; C30.1 C29.2 26.92,30.23 27.8,29.35 R37.2 28.57,28.58 30.48,26.67 U9.8 31.79,27.49 ; 31.79,27.49 33.46,27.49 34.16,28.19 35.09,28.19 35.85,27.43 C23.2 35.85,25.35 ; 35.85,25.35 C22.2 ; 35.85,25.35 35.96,25.45 R39.1 37.21,26.29 v1(37.47,26.54) ; v1(18.02,19.43) 17.89,19.3 13.97,19.3 13.15,20.12 U1.20 U1.21
  Bottom Layer w0.381: v1(34.42,34.42) 34.42,39.37 v1(41.66,46.61) ; v1(37.47,26.54) 38.35,26.54 38.99,25.91 38.99,24 ; 38.99,24 38.99,21.97 36.83,19.81 H1.1 ; 38.99,24 37.34,22.35 29.72,22.35 28.07,20.7 23.11,20.7 21.08,22.73 21.08,25.15 20.32,25.91 18.29,25.91 18.02,25.64 v1(18.02,19.43)
+5V: length 69
  Top Layer w0.254: v1(18.8,4.94) 18.91,4.94 19.43,5.46 ; U2.A3 U2.A2 ; USB1.A4 19.33,7.46 19.33,5.82 19.81,5.33 23.5,5.33 23.85,5.69 23.85,7.74 USB1.B4
  Top Layer w0.381: U11.1 3.48,11.38 v1(3.94,10.92) ; DC1.1 38.67,13.14 34.99,9.46 C1.2 24.7,9.46 24,8.76 24,7.89 24.14,7.75 ; 20.95,15.75 19.05,15.75 18.42,15.12 R4.2 ; v1(9.91,10.16) 10.92,11.18 D1.1 14.08,11.64 C2.2 16.19,11.43 R3.2 R4.2 ; R4.2 18.04,12.95 C6.2 15.81,14.61 C7.2
  Bottom Layer w0.381: v1(18.8,4.94) 16.4,4.94 11.18,10.16 v1(9.91,10.16) 4.7,10.16 v1(3.94,10.92)
GND: length 3.3
  Top Layer w0.203: U2.C3 U2.C2 U2.C1 21.84,14.48 22.99,13.34 R5.1
A_RX: length 52.6
  Top Layer w0.254: 24.69,36.47 D6.6
  Top Layer w0.381: 24.69,36.47 R42.2 24.69,47.32 CN1.2 21.97,50.93 25.15,54.1 38.86,54.1 46.23,46.74 46.23,41.4 45.66,40.84 U10.13
B_TX: length 40.6
  Top Layer w0.381: U10.14 45.21,41.49 45.47,41.74 45.47,45.97 41.4,50.04 CN1.1 27.05,47.63 26.16,46.74 26.16,38.41 R41.2 26.16,38.3 26.16,37.59 26.6,37.15 D6.4
BOOT: length 24.6
  Top Layer w0.254: v1(30.86,8.64) 30.73,8.51 SW2.1 ; U1.24 18.68,25.01 v1(19.05,24.64)
  Bottom Layer w0.254: v1(19.05,24.64) 19.05,21.72 30.86,9.91 v1(30.86,8.64)
GPIO9: length 19.7
  Top Layer w0.254: U1.28 18.83,29.81 19.69,28.96 19.69,18.8 v1(19.56,18.67) ; U2.E1 23.39,15.22 v1(23.75,14.86)
  Bottom Layer w0.254: v1(19.56,18.67) 19.94,18.67 v1(23.75,14.86)
GPIO21: length 26.8
  Top Layer w0.254: U1.41 8.41,39.09 v1(15.37,32.13) ; v1(22.61,29.34) 23.62,28.32 R36.1
  Bottom Layer w0.254: v1(22.61,29.34) 18.16,29.34 v1(15.37,32.13)
GPIO38: length 14.3
  Top Layer w0.254: 2.66,28.71 1.53,28.71 1.14,28.32 1.14,18.54 2.48,17.21 U11.4
GPIO40: length 28.5
  Top Layer w0.254: v1(4.57,26.21) 2.76,26.21 U1.13 ; v1(22.99,14.48) 22.84,14.48 22.26,15.06 22.26,15.21 U2.D1 ; v1(17.78,17.4) 12.06,17.4 v1(10.79,18.67)
  Bottom Layer w0.254: v1(4.57,26.21) 6.93,26.21 8.13,25.02 8.13,21.34 v1(10.79,18.67) ; v1(22.99,14.48) 20.07,17.4 v1(17.78,17.4)
GPIO43_TX: length 72.8
  Top Layer w0.254: v1(24.64,22.1) 24.64,22.61 25.02,22.99 26.25,22.99 U9.4 ; v1(15.81,29.02) 11.32,33.51 U1.7 ; v1(32.89,28.19) 32.89,30.1 33.15,30.35 41.28,30.35 45.72,34.8 45.72,39.12 45.3,39.54 U10.11 ; R34.1 28.78,29.39 29.34,28.83 30.28,28.83 30.28,28.14 v1(30.48,27.94)
  Bottom Layer w0.254: v1(30.48,27.94) 32.64,27.94 v1(32.89,28.19) ; v1(30.48,27.94) 30.48,25.15 27.43,22.1 v1(24.64,22.1) ; v1(30.48,27.94) 27.18,27.94 26.29,27.05 17.78,27.05 v1(15.81,29.02)
GPIO44_RX: length 61.7
  Top Layer w0.254: R37.1 25.05,27.33 25,27.33 ; 2.66,34.71 11.64,34.71 v1(15.62,30.73) ; 25,27.33 25.65,26.67 U9.1 ; 25,27.33 v1(24.64,27.69) ; U10.12 45.66,40.19 46.35,39.5 46.35,34.29 41.66,29.59 v1(33.53,29.59)
  Bottom Layer w0.254: v1(33.53,29.59) 26.54,29.59 v1(24.64,27.69) 18.67,27.69 v1(15.62,30.73)
RESET: length 15.6
  Top Layer w0.254: SW1.1 10.37,7.41 9.02,8.76 9.02,17.65 9.55,18.19 U1.17
USB_D+: length 42.5
  Top Layer w0.254: v1(4.44,38.1) 2.87,38.1 U1.3 ; 21.34,8.51 21.59,8.76 22.1,8.76 22.34,8.52 USB1.B6 ; 21.34,8.51 21.34,9.07 21.3,9.1 21.3,10.07 v1(21.08,10.29) ; 21.34,8.51 21.34,7.75 USB1.A6
  Bottom Layer w0.254: v1(21.08,10.29) 20.19,10.29 16.76,13.72 16.76,27.05 5.72,38.1 v1(4.44,38.1)
USB_D-: length 47.7
  Top Layer w0.254: v1(22.61,6.1) 22.48,5.97 21.97,5.97 21.59,6.35 21.59,6.48 ; USB1.B7 20.83,7.74 20.83,6.73 21.08,6.48 21.59,6.48 ; v1(6.73,35.81) 6.73,37.21 4.43,39.51 U1.2 ; USB1.A7 21.84,6.73 21.59,6.48
  Bottom Layer w0.254: v1(6.73,35.81) 6.73,35.31 14.86,27.18 14.86,13.97 19.81,9.02 20.42,9.02 22.1,7.34 22.1,6.6 v1(22.61,6.1)
$1N1486: length 2.6
  Top Layer w0.254: USB1.B5 23.34,8.54 23.11,8.76 22.87,8.76 R2.1
$1N1504: length 3.9
  Top Layer w0.254: L1.1 21.44,18.69 U2.B3 U2.B2
$1N1505: length 5.4
  Top Layer w0.254: L1.2 24.89,18.03 23.62,16.76 22.61,16.76 22.24,16.4 U2.D3 U2.D2
$1N1525: length 2.1
  Top Layer w0.254: R1.2 20.34,9.5 USB1.A5
$1N1571: length 17
  Top Layer w0.254: 27.62,13.72 27.56,13.78 25.91,13.78 ; 27.62,13.72 C10.1 ; 27.62,13.72 C11.2 27.62,18.48 28.96,19.81 H1.2 ; 22.73,15.88 23.69,15.88 C9.1 ; U2.E3 U2.E2
$1N1577: length 6.4
  Top Layer w0.254: C8.1 20.91,11.3 ; 20.91,11.3 20.18,11.3 20.06,11.43 ; 20.91,11.3 v1(20.91,12.07) ; v1(20.4,14.48) 20.4,14.56 21.04,15.2 U2.A1
  Bottom Layer w0.254: v1(20.91,12.07) 20.4,12.57 v1(20.4,14.48)
$1N1589: length 3.8
  Top Layer w0.254: U2.B1 21.44,15.07 21.24,14.87 21.24,13.7 R5.2 R4.1
$2N1090: length 3
  Top Layer w0.254: 28.26,32.78 29.59,31.45 29.59,30.41 R34.2
$2N1107: length 35.3
  Top Layer w0.254: v1(36.45,23.11) 36.58,23.11 37.21,23.75 37.21,24.59 37.92,24.59 38.48,25.15 38.48,26.67 36.19,28.96 v1(35.43,28.96) ; 23.82,38.35 23.7,38.23 22.99,38.23 22.61,38.61 v1(22.61,38.99) ; U9.6 32.77,24.13 v1(33.4,23.5)
  Bottom Layer w0.254: v1(35.43,28.96) 35.43,32.51 28.45,39.5 23.11,39.5 v1(22.61,38.99) ; v1(36.45,23.11) 33.78,23.11 v1(33.4,23.5)
$2N1108: length 19.9
  Top Layer w0.254: 31.79,25.4 31.86,25.33 R38.2 33.53,26.09 v1(33.53,26.42) ; v1(28.07,38.48) 27.1,38.48 R41.1
  Bottom Layer w0.254: v1(28.07,38.48) 34.16,32.39 34.16,28.7 33.53,28.07 v1(33.53,26.42)
$2N1109: length 26.2
  Top Layer w0.254: 26.38,25.4 U9.3 26.36,24.15 R36.2 22.21,24.15 21.21,25.15 v1(21.21,31.62) ; v1(27.81,34.54) 28.05,34.78 Q6.3 31.5,34.78 R35.1
  Bottom Layer w0.254: v1(27.81,34.54) 27.18,33.91 27.18,32.89 26.92,32.64 21.97,32.64 21.21,31.88 v1(21.21,31.62)
$2N1110: length 7.5
  Top Layer w0.254: U10.3 v1(34.67,41.49) ; C33.1 31.05,42.23 v1(30.73,41.91)
  Bottom Layer w0.254: v1(30.73,41.91) 31.16,41.49 v1(34.67,41.49)
$2N1111: length 2.9
  Top Layer w0.254: U10.5 36.5,40.13 35.05,40.13 34.1,39.18 C34.1
$2N1112: length 5.8
  Top Layer w0.254: U10.1 34.77,44.58 32.64,44.58 32.13,44.07 C33.2
$2N1113: length 2.6
  Top Layer w0.254: U10.4 36.55,40.83 35.12,40.83 34.86,40.58 C34.2
$2N1124: length 3.7
  Top Layer w0.254: U10.2 35.2,42.14 34.93,42.42 34.93,43.18 34.48,43.63 C35.2
$2N1126: length 11.2
  Top Layer w0.254: v1(30.73,40.13) 31.18,40.58 C36.2 ; U10.6 35.47,39.54 34.93,38.99 34.93,38.35 v1(33.66,37.08)
  Bottom Layer w0.254: v1(30.73,40.13) 30.73,38.23 31.88,37.08 v1(33.66,37.08)
$2N1128: length 6.2
  Top Layer w0.254: C37.1 39.69,43.25 40.79,42.14 U10.15

## Copper pours and planes (outline as drawn; the poured copper is in the pictures)
GND on Top Layer: -8.51,64.52 50.67,64.52 50.67,-0.76 -8.51,-0.76
GND on Bottom Layer: -6.73,62.1 53.59,62.1 53.59,-4.95 -6.73,-4.95

## Text on the board
Bottom Silkscreen Layer: GND | RX | TX
Top Silkscreen Layer: GND | RX | TX
